# Altium schematic sheet Power Supplies.SchDoc: EEG Measurement Circuit
size A3; Date: 24/01/2025; DrawnBy: Giang Phan Truong; SheetNumber: 2; SheetTotal: 7
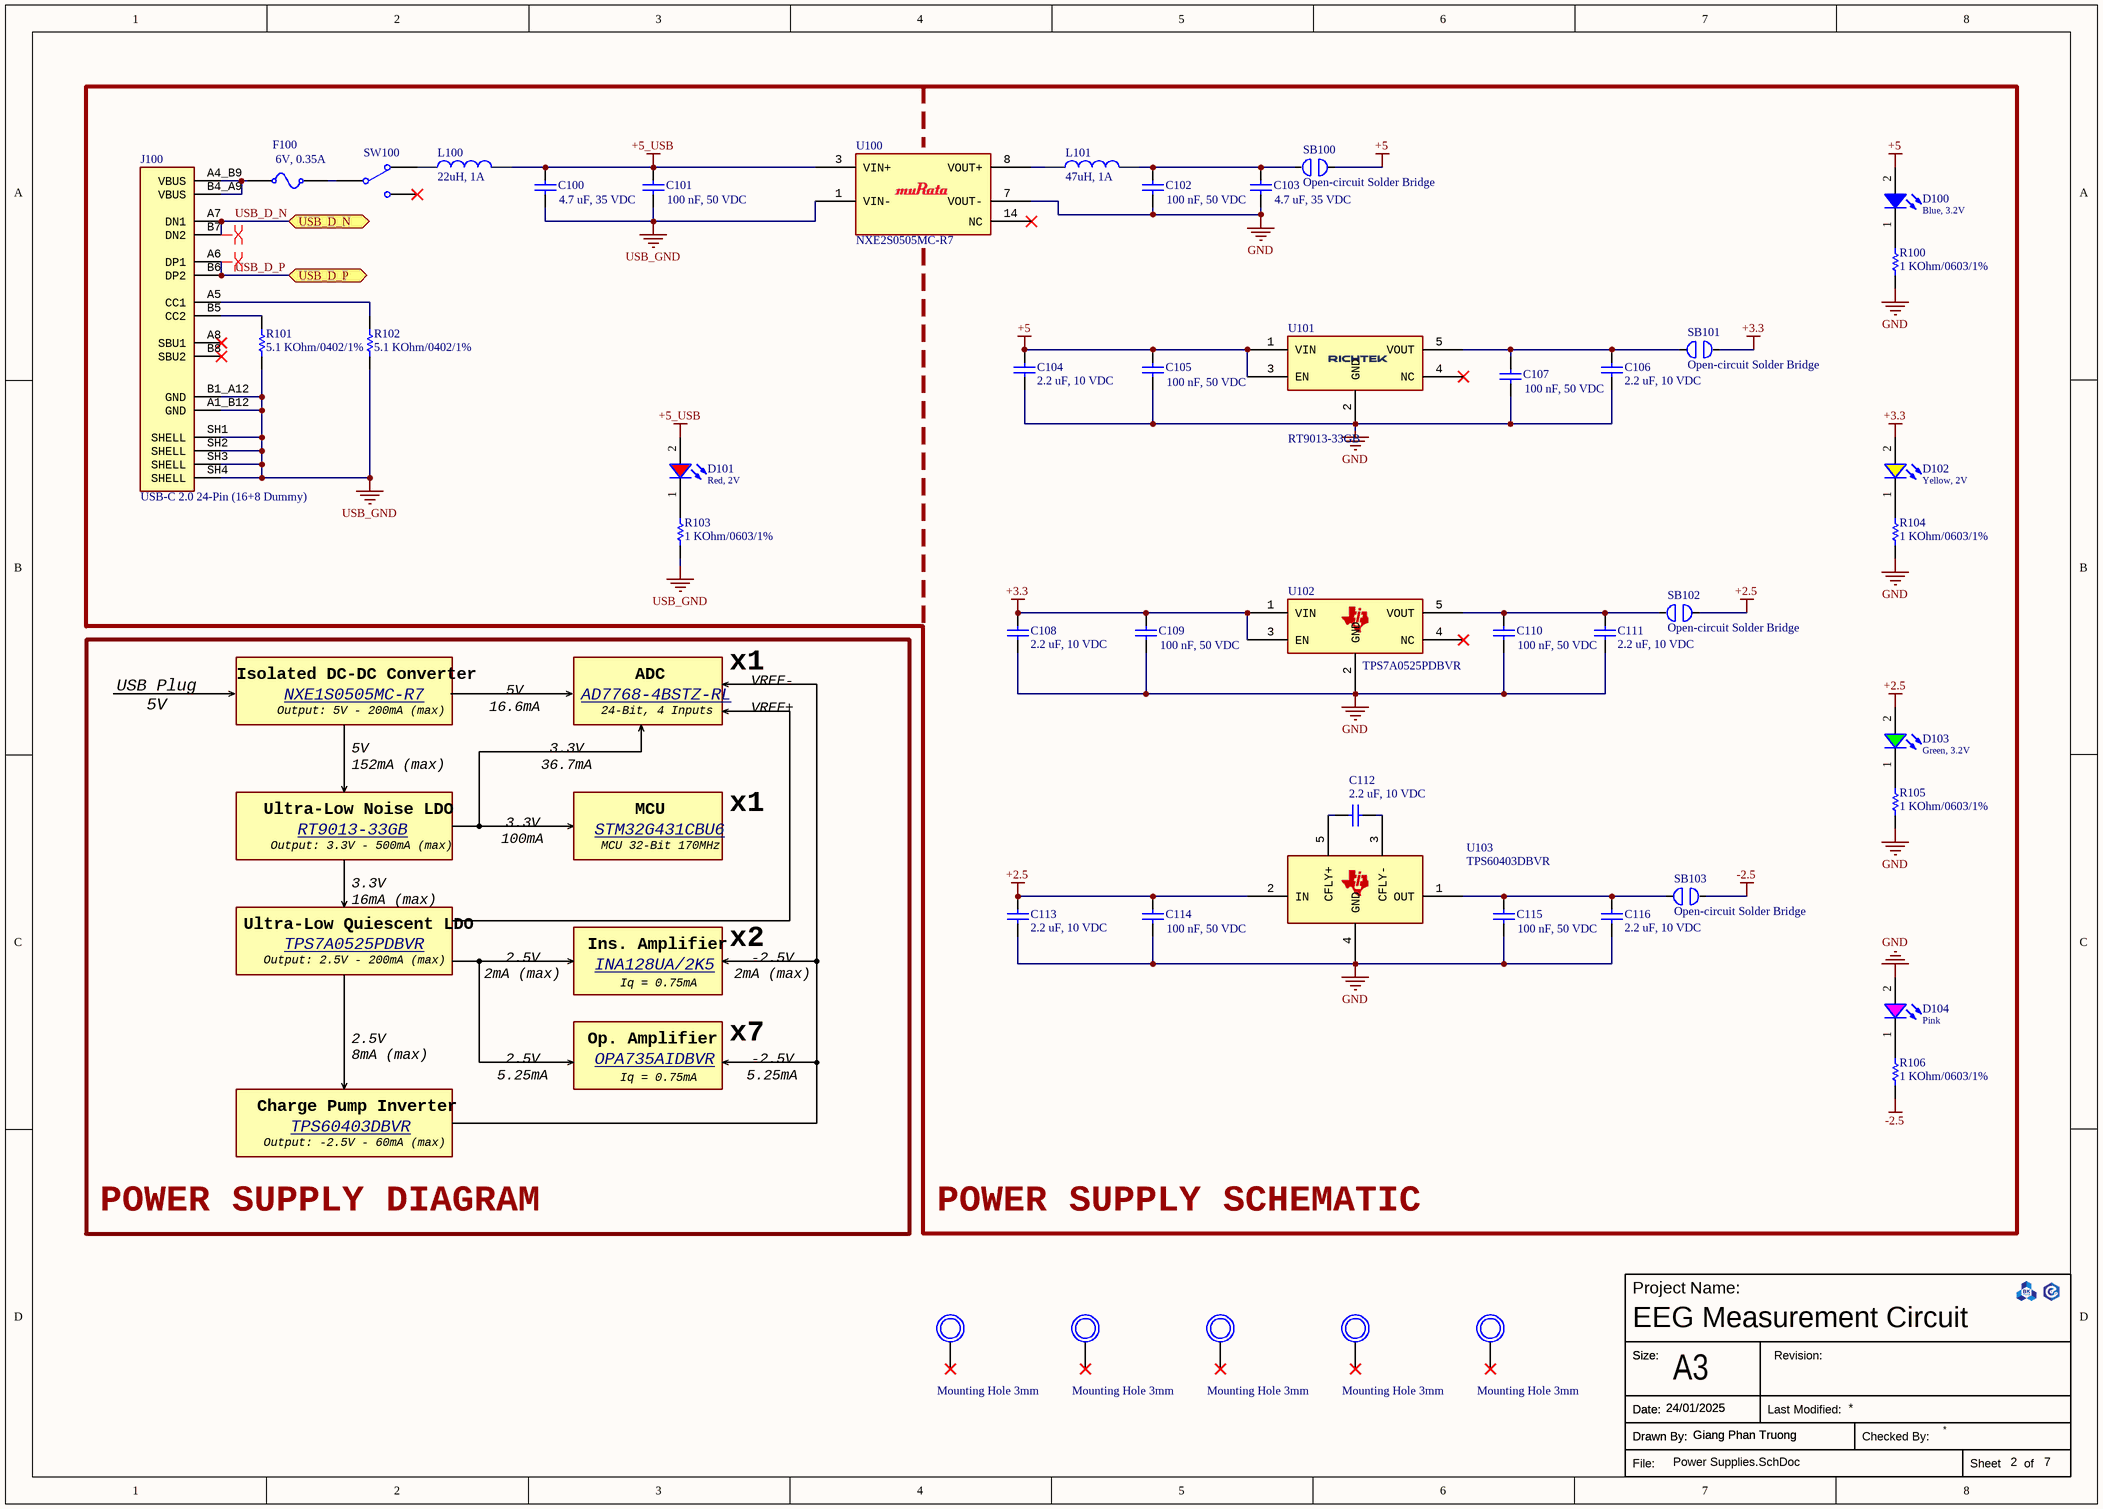
[diagram p0: Power Supplies.SchDoc]

## Parts
C100  4.7 uF, 35 VDC  [CAP_0603]
C101  100 nF, 50 VDC  [CAP_0603]
C102  100 nF, 50 VDC  [CAP_0603]
C103  4.7 uF, 35 VDC  [CAP_0603]
C104  2.2 uF, 10 VDC  [CAP_0603]
C105  100 nF, 50 VDC  [CAP_0603]
C106  2.2 uF, 10 VDC  [CAP_0603]
C107  100 nF, 50 VDC  [CAP_0603]
C108  2.2 uF, 10 VDC  [CAP_0603]
C109  100 nF, 50 VDC  [CAP_0603]
C110  100 nF, 50 VDC  [CAP_0603]
C111  2.2 uF, 10 VDC  [CAP_0603]
C112  2.2 uF, 10 VDC  [CAP_0603]
C113  2.2 uF, 10 VDC  [CAP_0603]
C114  100 nF, 50 VDC  [CAP_0603]
C115  100 nF, 50 VDC  [CAP_0603]
C116  2.2 uF, 10 VDC  [CAP_0603]
D100  Blue, 3.2V  [WL-SMCW_0603_H=0.7mm]
D101  Red, 2V  [WL-SMCW_0603_H=0.7mm]
D102  Yellow, 2V  [WL-SMCW_0603_H=0.7mm]
D103  Green, 3.2V  [WL-SMCW_0603_H=0.7mm]
D104  Pink  [WL-SMCW_0603_H=0.7mm]
F100  6V, 0.35A  [Fuse_SMD_1206]
H100  Mounting Hole 3mm  [3mm with via]
H101  Mounting Hole 3mm  [3mm with via]
H102  Mounting Hole 3mm  [3mm with via]
H103  Mounting Hole 3mm  [3mm with via]
H?  Mounting Hole 3mm  [3mm with via]
J100  value USB-C 2.0 24-Pin (16+8 Dummy)  [GCT_USB4105-GF-A]  (hidden comment: USB4105-GF-A)
L100  22uH, 1A  [Inductor_CDRH4D28]
L101  47uH, 1A  [Inductor_CDRH4D28]
R100  value 1 KOhm/0603/1%  [R0603]  (hidden comment: Resistor 1 KOhm 0603 1%)
R101  value 5.1 KOhm/0402/1%  [R0402]  (hidden comment: Resistor 5.1 KOhm 0402)
R102  value 5.1 KOhm/0402/1%  [R0402]  (hidden comment: Resistor 5.1 KOhm 0402)
R103  value 1 KOhm/0603/1%  [R0603]  (hidden comment: Resistor 1 KOhm 0603 1%)
R104  value 1 KOhm/0603/1%  [R0603]  (hidden comment: Resistor 1 KOhm 0603 1%)
R105  value 1 KOhm/0603/1%  [R0603]  (hidden comment: Resistor 1 KOhm 0603 1%)
R106  value 1 KOhm/0603/1%  [R0603]  (hidden comment: Resistor 1 KOhm 0603 1%)
SB100  Open-circuit Solder Bridge  [SolderBridgeOpen]
SB101  Open-circuit Solder Bridge  [SolderBridgeOpen]
SB102  Open-circuit Solder Bridge  [SolderBridgeOpen]
SB103  Open-circuit Solder Bridge  [SolderBridgeOpen]
SW100  450404015514  [450404015514]  (value not drawn)
U100  NXE2S0505MC-R7  [NXE2_SINGLE_SURFACE_MUR]
U101  RT9013-33GB  [SOT-23-5_RIT-L]
U102  TPS7A0525PDBVR  [DBV0005A_L]
U103  TPS60403DBVR  [SOT95P280X145-5N]

## Blocks framed on the sheet
POWER SUPPLY SCHEMATIC: C100-C116 D100-D104 F100 J100 L100 L101 R100-R106 SB100-SB103 SW100 U100-U103

## Ports
USB_D_N (bidir, see Block Diagram[7B], Interface[3B]), USB_D_P (bidir, see Block Diagram[7B], Interface[3B])

## Nets
+2.5: C113.2 C114.2 D103.2(A) SB102.1 U103.2(IN)
+3.3: C108.2 C109.2 D102.2(A) SB101.1 U102.1(VIN) U102.3(EN)
+5: C104.2 C105.2 D100.2(A) SB100.1 U101.1(VIN) U101.3(EN)
+5_USB: C100.2 C101.2 D101.2(A) L100.2 U100.3(VIN+)
-2.5: R106.2 SB103.1
GND: C102.1 C103.1 C104.1 C105.1 C106.1 C107.1 C108.1 C109.1 C110.1 C111.1 C113.1 C114.1 C115.1 C116.1 D104.2(A) R100.2 R104.2 R105.2 U100.7(VOUT-) U101.2(GND) U102.2(GND) U103.4(GND)
USB_GND: C100.1 C101.1 J100.A1_B12(GND) J100.B1_A12(GND) J100.SH1(SHELL) J100.SH2(SHELL) J100.SH3(SHELL) J100.SH4(SHELL) R101.1 R102.1 R103.1 U100.1(VIN-)
USB_D_N: J100.A7(DN1) J100.B7(DN2) ; port USB_D_N
USB_D_P: J100.A6(DP1) J100.B6(DP2) ; port USB_D_P
NetC102_2: C102.2 C103.2 L101.2 SB100.2
NetC106_2: C106.2 C107.2 SB101.2 U101.5(VOUT)
NetC110_2: C110.2 C111.2 SB102.2 U102.5(VOUT)
NetC112_1: C112.1 U103.3(CFLY-)
NetC112_2: C112.2 U103.5(CFLY+)
NetC115_2: C115.2 C116.2 SB103.2 U103.1(OUT)
NetD100_1: D100.1(K) R100.1
NetD101_1: D101.1(K) R103.2
NetD102_1: D102.1(K) R104.1
NetD103_1: D103.1(K) R105.1
NetD104_1: D104.1(K) R106.1
NetF100_0: F100.0 J100.A4_B9(VBUS) J100.B4_A9(VBUS)
NetF100_1: F100.1 SW100.COM
NetJ100_A5: J100.A5(CC1) R102.2
NetJ100_B5: J100.B5(CC2) R101.2
NetL100_1: L100.1 SW100.L1
NetL101_1: L101.1 U100.8(VOUT+)

Not connected (* = marked no-connect by the designer): H100 0; H101 0; H102 0; H103 0; H? 0; J100 A8(SBU1)* B8(SBU2)*; SW100 L2*; U100 14(NC)*; U101 4(NC)*; U102 4(NC)*

## Layout directives
differential pair: USB_D_N, USB_D_P

## Notes on the sheet
- USB Plug
  5V
- Isolated DC-DC Converter
- Output: 5V - 200mA (max)
- NXE1S0505MC-R7 <https://www.digikey.com/en/products/detail/murata-power-solutions-inc/NXE1S0505MC-R7/5047366>
- 5V
  16.6mA (max)
- AD7768-4BSTZ-RL <https://www.digikey.com/en/products/detail/analog-devices-inc/AD7768-4BSTZ-RL/6056981>
- 24-Bit, 4 Inputs
- ADC
- x1
- VREF-
- 5V
  152mA (max)
- 3.3V
  36.7mA (max)
- VREF+
- Ultra-Low Noise LDO
- Output: 3.3V - 500mA (max)
- RT9013-33GB <https://www.thegioiic.com/rt9013-33gb-ic-on-ap-3-3v-500ma-sot-23-5>
- 3.3V
  100mA (max)
- STM32G431CBU6 <https://www.digikey.com/en/products/detail/stmicroelectronics/STM32G431CBU6/10231569>
- MCU 32-Bit 170MHz
- MCU
- 3.3V
  16mA (max)
- Ultra-Low Quiescent LDO
- Output: 2.5V - 200mA (max)
- TPS7A0525PDBVR <https://www.digikey.com/en/products/detail/texas-instruments/TPS7A0525PDBVR/9489224>
- 2.5V
  2mA (max)
- Ins. Amplifier
- INA128UA/2K5 <https://www.digikey.com/en/products/detail/texas-instruments/INA128UA-2K5/300998>
- Iq = 0.75mA
- x2
- -2.5V
  2mA (max)
- 2.5V
  8mA (max)
- Op. Amplifier
- x7
- Charge Pump Inverter
- 2.5V
  5.25mA (max)
- OPA735AIDBVR <https://www.digikey.com/en/products/detail/texas-instruments/OPA735AIDBVR/1572946>
- -2.5V
  5.25mA (max)
- Output: -2.5V - 60mA (max)
- TPS60403DBVR <https://www.digikey.com/en/products/detail/texas-instruments/TPS60403DBVR/1672064>
- POWER SUPPLY DIAGRAM
- Project Name:
- Size
- Size:
- A3
- Revision:
- Drawn By:
- Date:
- File:
- Last Modified:
- Checked By:
- Sheet
- of

## Library data of the parts
C100 C103 = 0106034751035: CAP, size 0603, 4.7 uF, 35 VDC; Manufacture Name: Samsung Electro-Mechanics; Manufacture SN: CL10A475KL8NRNC; Capacitance: 4.7 uF; Tolerance: +/-10%; Voltage Rating DC: 35 VDC; ComponentLink2Description: Datasheet; ComponentLink2URL: https://www.mouser.vn/datasheet/2/585/MLCC-1837944.pdf; Operating Temperature: -55 to +125degC; Packaging: Tape and Reel; Mounting Technology: SMT; Size: 0603; Supplier 1 Name: Mouser; Supplier 1 SN: 187-CL10A475KL8NRNC; Supplier 1 URL: https://www.mouser.vn/ProductDetail/Samsung-Electro-Mechanics/CL10A475KL8NRNC?qs=xZ%2FP%252Ba9zWqa0jfvJtp%252BUEg%3D%3D&utm_source=mouser-refine-download&utm_medium=file&utm_campaign=CL10A475KL8NRNC&utm_content=Samsung-Electro-Mechanics; Supplier 2 Name: Digi-Key; Supplier 2 SN: 1276-6794-2-ND; Supplier 2 URL: https://www.digikey.com/en/products/detail/samsung-electro-mechanics/cl10a475kl8nrnc/5961278; Supplier 3 Name: thegioiic; Supplier 3 SN: N/A; Supplier 3 URL: N/A; Value: 4.7 uF, 35 VDC; ComponentLink3Description: Buy; ComponentLink3URL: http://www.tme.vn/Product.aspx?id=1163#page=pro_info
C101 C102 C105 C107 C109 C110 C114 C115 = 0106031041050: CAP, size 0603, 100 nF, 50 VDC; Manufacture Name: TDK; Manufacture SN: CGA3E3X8R1H104K080AE; Capacitance: 100 nF; Tolerance: +/-10%; Voltage Rating DC: 50 VDC; ComponentLink2Description: Datasheet; ComponentLink2URL: https://product.tdk.com/system/files/dam/doc/product/capacitor/ceramic/mlcc/catalog/mlcc_automotive_soft_en.pdf?ref_disty=mouser; Operating Temperature: -55 to +125degC; Packaging: Tape and Reel; Mounting Technology: SMT; Size: 0603; Supplier 1 Name: Mouser; Supplier 1 SN: 810-CGA3E3X8R1H104KA; Supplier 1 URL: https://www.mouser.com/ProductDetail/TDK/CGA3E3X8R1H104K080AE?qs=nQSIdc08i%252Bd8g3IRRgU2bw%3D%3D&utm_source=mouser-refine-download&utm_medium=file&utm_campaign=CGA3E3X8R1H104K080AE&utm_content=TDK; Supplier 2 Name: Digi-Key; Supplier 2 SN: 445-173697-2-ND; Supplier 2 URL: https://www.digikey.com/en/products/detail/tdk-corporation/cga3e3x8r1h104k080ae/5809262; Supplier 3 Name: thegioiic; Supplier 3 SN: N/A; Supplier 3 URL: N/A; Value: 100 nF, 50 VDC
  C101 C102 C105: ComponentLink3Description: Buy; ComponentLink3URL: http://www.tme.vn/Product.aspx?id=739#page=pro_info
C104 C106 C108 C111-C113 C116 = 0106032251010: CAP, size 0603, 2.2 uF, 10 VDC; Manufacture Name: Samsung Electro-Mechanics; Manufacture SN: CL10A225KP8NNWC; Capacitance: 2.2 uF; Tolerance: +/-10%; Voltage Rating DC: 10 VDC; ComponentLink2Description: Datasheet; ComponentLink2URL: https://www.mouser.vn/datasheet/2/585/Samsung_MLCC_1837944-1929650.pdf; Operating Temperature: -55 to +125degC; Packaging: Tape and Reel; Mounting Technology: SMT; Size: 0603; Supplier 1 Name: Mouser; Supplier 1 SN: 187-CL10A225KP8NNWC; Supplier 1 URL: https://www.mouser.vn/ProductDetail/Samsung-Electro-Mechanics/CL10A225KP8NNWC?qs=f6khj2Jg0Fj5oIVDjMV6rg%3D%3D&utm_source=mouser-refine-download&utm_medium=file&utm_campaign=CL10A225KP8NNWC&utm_content=Samsung-Electro-Mechanics; Supplier 2 Name: Digi-Key; Supplier 2 SN: 1276-CL10A225KP8NNWCTR-ND; Supplier 2 URL: https://www.digikey.com/en/products/detail/samsung-electro-mechanics/cl10a225kp8nnwc/16572766; Supplier 3 Name: thegioiic; Supplier 3 SN: N/A; Supplier 3 URL: N/A; Value: 2.2 uF, 10 VDC
D100 = 160603BlueBlur: WL-SMCW SMT Mono-color Chip LED Blur, size 0603, Blue, 3.2V, 140deg; Color: Blue; Size: 0603; Type: Blur; ComponentLink1Description: Datasheet link; ComponentLink1URL: N/A; ComponentLink2Description: Supplier 1 URL; ComponentLink2URL: https://www.mouser.vn/ProductDetail/ams-OSRAM/LB-Q39E-L2OO-35-1?qs=74fRo9GAWsz%2FeNvglIOl1w%3D%3D; ComponentLink3Description: Supplier 2 URL; ComponentLink3URL: https://www.digikey.com/en/products/detail/ams-osram-usa-inc/LB-Q39E-N1OO-35-1/2176321; ComponentLink4Description: Supplier 3 URL; ComponentLink4URL: N/A; Supplier 1 Name: Mouser; Supplier 1 SN: 720-LBQ39EL2N2351; Supplier 1 URL: https://www.mouser.vn/ProductDetail/ams-OSRAM/LB-Q39E-L2OO-35-1?qs=74fRo9GAWsz%2FeNvglIOl1w%3D%3D; Supplier 2 Name: Digi-Key; Supplier 2 SN: 475-LBQ39E-N1OO-35-1TR-ND; Supplier 2 URL: https://www.digikey.com/en/products/detail/ams-osram-usa-inc/LB-Q39E-N1OO-35-1/2176321; Supplier 3 Name: ICDayRoi; Supplier 3 SN: N/A; Supplier 3 URL: N/A; Value: Blue, 3.2V; ComponentLink5Description: Buy; ComponentLink5URL: https://www.thegioiic.com/led-xanh-duong-0603-dan-smd-trong-suot-harvatek
D101 = 160603RedClear: WL-SMCW SMT Mono-color Chip LED Waterclear, size 0603, Red, 2V, 140deg; Type: Clear; Color: Red; Size: 0603; ComponentLink1Description: Datasheet link; ComponentLink1URL: N/A; ComponentLink2Description: Supplier 1 URL; ComponentLink2URL: https://www.mouser.vn/ProductDetail/Wurth-Elektronik/150060RS75000?qs=LlUlMxKIyB3QnmZ3fw%2FVCA%3D%3D; ComponentLink3Description: Supplier 2 URL; ComponentLink3URL: https://www.digikey.com/en/products/detail/liteon/LTST-C191KRKT/386837; ComponentLink4Description: Supplier 3 URL; ComponentLink4URL: https://www.thegioiic.com/led-do-0603-dan-smd-trong-suot; Supplier 1 Name: Mouser; Supplier 1 SN: 710-150060RS75000; Supplier 1 URL: https://www.mouser.vn/ProductDetail/Wurth-Elektronik/150060RS75000?qs=LlUlMxKIyB3QnmZ3fw%2FVCA%3D%3D; Supplier 2 Name: Digi-Key; Supplier 2 SN: 160-1447-2-ND; Supplier 2 URL: https://www.digikey.com/en/products/detail/liteon/LTST-C191KRKT/386837; Supplier 3 Name: ICDayRoi; Supplier 3 SN: N/A; Supplier 3 URL: https://www.thegioiic.com/led-do-0603-dan-smd-trong-suot; Value: Red, 2V
D102 = 160603YellowBlur: WL-SMCW SMT Mono-color Chip LED Blur, size 0603, Yellow, 2V, 140deg; Color: Yellow; Size: 0603; Type: Blur; ComponentLink1Description: Datasheet link; ComponentLink1URL: N/A; ComponentLink2Description: Supplier 1 URL; ComponentLink2URL: https://www.mouser.vn/ProductDetail/ROHM-Semiconductor/CSL1901YW1?qs=vvQtp7zwQdO0NUeC1uqWRA%3D%3D; ComponentLink3Description: Supplier 2 URL; ComponentLink3URL: https://www.digikey.com/en/products/detail/rohm-semiconductor/SML-D12Y8WT86/1641801; ComponentLink4Description: Supplier 3 URL; ComponentLink4URL: N/A; Supplier 1 Name: Mouser; Supplier 1 SN: 755-CSL1901YW1; Supplier 1 URL: https://www.mouser.vn/ProductDetail/ROHM-Semiconductor/CSL1901YW1?qs=vvQtp7zwQdO0NUeC1uqWRA%3D%3D; Supplier 2 Name: Digi-Key; Supplier 2 SN: 511-1582-2-ND; Supplier 2 URL: https://www.digikey.com/en/products/detail/rohm-semiconductor/SML-D12Y8WT86/1641801; Supplier 3 Name: ICDayRoi; Supplier 3 SN: N/A; Supplier 3 URL: N/A; Value: Yellow, 2V; ComponentLink5Description: Buy; ComponentLink5URL: https://www.thegioiic.com/led-vang-0603-dan-smd-trong-suot
D103 = 160603GreenBlur: WL-SMCW SMT Mono-color Chip LED Blur, size 0603, Green, 3.2V, 140deg; Color: Green; Size: 0603; Type: Blur; ComponentLink1Description: Datasheet link; ComponentLink1URL: N/A; ComponentLink2Description: Supplier 1 URL; ComponentLink2URL: https://www.mouser.vn/ProductDetail/ROHM-Semiconductor/SMLD12EN1WT86?qs=qSfuJ%252Bfl%2Fd4fR%252B9yZydIwg%3D%3D; ComponentLink3Description: Supplier 2 URL; ComponentLink3URL: https://www.digikey.com/en/products/detail/rohm-semiconductor/SML-D12M8WT86/1641797; ComponentLink4Description: Supplier 3 URL; ComponentLink4URL: N/A; Supplier 1 Name: Mouser; Supplier 1 SN: 755-SMLD12EN1WT86; Supplier 1 URL: https://www.mouser.vn/ProductDetail/ROHM-Semiconductor/SMLD12EN1WT86?qs=qSfuJ%252Bfl%2Fd4fR%252B9yZydIwg%3D%3D; Supplier 2 Name: Digi-Key; Supplier 2 SN: 511-1578-2-ND; Supplier 2 URL: https://www.digikey.com/en/products/detail/rohm-semiconductor/SML-D12M8WT86/1641797; Supplier 3 Name: ICDayRoi; Supplier 3 SN: N/A; Supplier 3 URL: N/A; Value: Green, 3.2V; ComponentLink5Description: Buy; ComponentLink5URL: https://www.thegioiic.com/led-xanh-la-0603-dan-smd-trong-suot
D104 = 160603PinkBlur: WL-SMCW SMT Mono-color Chip LED Blur, size 0603, Pink; Color: Pink; Size: 0603; Type: Blur; ComponentLink1Description: Datasheet link; ComponentLink1URL: N/A; ComponentLink2Description: Supplier 1 URL; ComponentLink2URL: N/A; ComponentLink3Description: Supplier 2 URL; ComponentLink3URL: https://www.digikey.com/en/products/detail/rohm-semiconductor/SMLD12HBC7W1/3587026; ComponentLink4Description: Supplier 3 URL; ComponentLink4URL: N/A; Supplier 1 Name: Mouser; Supplier 1 SN: N/A; Supplier 1 URL: N/A; Supplier 2 Name: Digi-Key; Supplier 2 SN: 846-1108-2-ND; Supplier 2 URL: https://www.digikey.com/en/products/detail/rohm-semiconductor/SMLD12HBC7W1/3587026; Supplier 3 Name: ICDayRoi; Supplier 3 SN: N/A; Supplier 3 URL: N/A; Value: Pink; ComponentLink5Description: Buy; ComponentLink5URL: https://www.thegioiic.com/led-hong-0603-dan-smd-trong-suot
F100 = 061206035006: Resettable Fuse, Size 1206, 6V, 0.35A; Manufacturer: Bourns; Manufacturer Part Number: MF-NSMF035-2; Threshold Current: 100A; Trip Current: 0.75A; Threshold Voltage: 6V; Hold Current: 0.35A; ComponentLink1Description: Datasheet; ComponentLink1URL: https://www.bourns.com/docs/Product-Datasheets/mfnsmf.pdf; Supplier 1 URL: https://www.mouser.vn/ProductDetail/Bourns/MF-NSMF035-2?qs=3eVyCPG4fwnHDrvs%2FGppSw%3D%3D; Supplier 2 URL: https://www.mouser.vn/ProductDetail/Bourns/MF-NSMF035-2?qs=3eVyCPG4fwnHDrvs%2FGppSw%3D%3D; Supplier 3 URL: https://www.thegioiic.com/mf-nsmf035-2-cau-chi-tu-phuc-hoi-1206-6v-0-35a; Value: 6V, 0.35A; Mount: SMD/SMT; Package / Case: 1206; Packaging: Tape and Reel; Supplier 1: Mouser; Supplier 1 Part Number: 652-MF-NSMF035-2; Supplier 2: Digi-Key; Supplier 2 Part Number: MF-NSMF035-2TR-ND; Supplier 3: thegioiic; Supplier 3 Part Number: MF-NSMF035-2; LCSC Part #: N/A
J100 = USB4105-GF-A: USB-C (USB TYPE-C) USB 2.0 Receptacle Connector 24 (16+8 Dummy) Position Surface Mount, Right Angle; Through Hole; MF: {'manufacturer': u'GCT'}; Package: None; Price: None; MP: USB4105-GF-A; Availability: Unavailable; ComponentLink1Description: Buy; ComponentLink1URL: https://www.thegioiic.com/cong-usb-cai-3-1-type-c-16-chan-thang-dan-smd
L100 = IND_22uH_4D28: 22uH 20% 1A SMD Power Inductor 4.8x4.8x2.8 mm; Supply Name: tme; Supply Part Number: 22uH 20% 1A SMD Power Inductor 4.8x4.8x2.8 mm; Supply URL: http://www.tme.vn/Product.aspx?id=1639#page=pro_info; Value: 22uH, 1A; ComponentLink1Description: Buy; ComponentLink1URL: http://tme.vn/Product.aspx?id=1639#page=pro_info
L101 = IND_47uH_4D28: 47uH 20% 1A SMD Power Inductor 4.8x4.8x2.8 mm; Supply Part Number: 22uH 20% 1A SMD Power Inductor 4.8x4.8x2.8 mm; Supply Name: tme; ComponentLink1Description: Buy; ComponentLink1URL: http://www.tme.vn/Product.aspx?id=1640#page=pro_info; Value: 47uH, 1A
R100 R103-R106 = Resistor 1 KOhm 0603 1%: Code 102, 1/10W; ComponentLink1Description: Buy; ComponentLink1URL: https://www.thegioiic.com/dien-tro-1-kohm-0603-1
R101 R102 = Resistor 5.1 KOhm 0402: RC0402FR-135K1L; ComponentLink1Description: Buy; ComponentLink1URL: https://www.digikey.com/en/products/detail/yageo/RC0402FR-135K1L/14286364
SW100 = 450404015514: WS-SLSU Mini Slide Switch, Same Side Connection Side Push, SPDT, 5VDC, 300mA, 240g; Manufacturer: Wurth Elektronik; Manufacturer Part Number: 450404015514; Category: Slide Switches; Match Code: WS-SLSU; Mount: Surface Mount; Operating Temperature Max: 85°C; Operating Temperature Min: -40°C; Packaging: Tape and Reel; Length: 6.7mm; Width: 2.7mm; Height: 1.1mm; Circuit: SPDT; Contact Material: Copper Alloy; Contact Plating: Silver; Operation Force: 240g; Rated Current: 300mA; Rated Voltage: 5VDC; Terminal Material: Copper Alloy; Terminal Plating: Silver; Supplier 1 URL: https://www.mouser.com/ProductDetail/Wurth-Elektronik/450404015514?qs=sPbYRqrBIVk21%2FxsES2IZA%3D%3D; Supplier 2 URL: https://www.digikey.com/en/products/detail/w%C3%BCrth-elektronik/450404015514/9950812; Supplier 3 URL: https://www.thegioiic.com/msk-12c02-cong-tac-truot-7-chan-on-off-smd-chinh-ngang-1p2t-0-5a; LCSC Part #: N/A; ComponentLink1Description: Datasheet; ComponentLink1URL: https://www.we-online.com/redexpert/spec/450404015514?ad; Supplier 1: Mouser; Supplier 1 Part Number: 710-450404015514; Supplier 2: Digi-Key; Supplier 2 Part Number: 732-13665-2-ND; Supplier 3: thegioiic; Supplier 3 Part Number: MSK-12C02; Value: 450404015514
U100 = NXE2S0505MC-R7: Isolated Module DC DC Converter 1 Output 5V 400mA 4.5V - 5.5V Input; Mfr_Name: Murata; RefDes: RefDes; Type: Type; ComponentLink1Description: Buy; ComponentLink1URL: https://www.digikey.com/en/products/detail/murata-power-solutions-inc/NXE2S0505MC-R7/6009739; Value: NXE2S0505MC-R7
U101 = RT9013-33GB: Linear Voltage Regulator IC Positive Fixed 1 Output 500mA SOT-23-5; Mfr_Name: Richtek Technology; RefDes: RefDes; Type: Type; ComponentLink1Description: Buy; ComponentLink1URL: https://www.digikey.com/en/products/detail/richtek-usa-inc/RT9013-33GB/2546347; Value: RT9013-33GB
U102 = TPS7A0525PDBVR: Linear Voltage Regulator IC Positive Fixed 1 Output 200mA SOT-23-5; Mfr_Name: Texas Instruments; TYPE: TYPE; RefDes: RefDes; ComponentLink1Description: Buy; ComponentLink1URL: https://www.digikey.com/en/products/detail/texas-instruments/TPS7A0525PDBVR/9489224; Value: TPS7A0525PDBVR
U103 = TPS60403DBVR: 60mA Charge Pump Voltage Inverter with Fixed 250kHz Operation; MF: Texas Instruments; Mouser-Purchase-URL: https://snapeda.com/shop?store=Mouser&id=1101412; Availability: Unavailable; Price: None; Package: SOT-23-5 Texas Instruments; DigiKey-Purchase-URL: https://snapeda.com/shop?store=DigiKey&id=1101412; MP: TPS60403DBVR; SnapEDA_Link: https://www.snapeda.com/parts/TPS60403DBVR/Texas%20Instruments/view-part/1101412/?ref=snap; Arrow_Electronics-Purchase-URL: https://snapeda.com/shop?store=Arrow+Electronics&id=1101412; Texas_Instruments-Purchase-URL: https://snapeda.com/shop?store=Texas+Instruments&id=1101412; ComponentLink1Description: Buy; ComponentLink1URL: https://www.digikey.com/en/products/detail/texas-instruments/TPS60403DBVR/1672064; Value: TPS60403DBVR